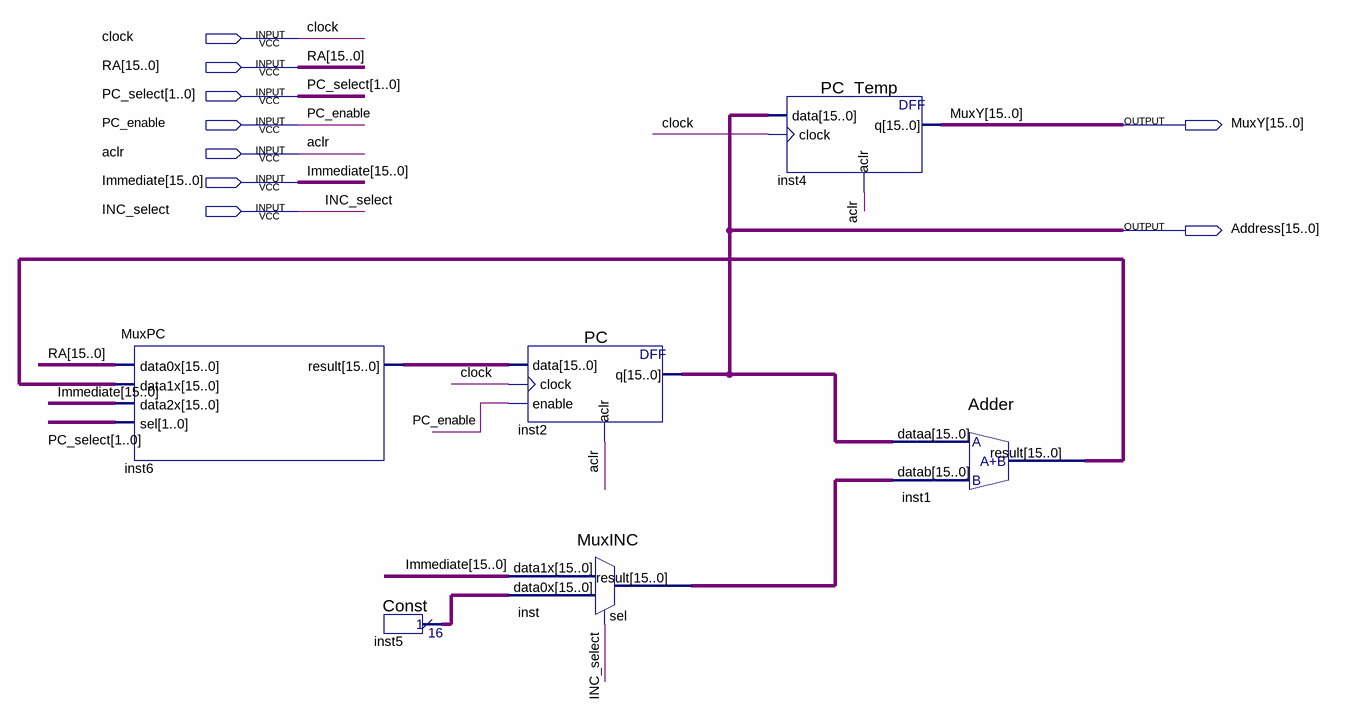
[diagram p0: schematic sheet]
// Quartus schematic InstructionAddressGenerator.bdf as structural Verilog: 6 symbols, 9 pins
module InstructionAddressGenerator (
  input  clock,
  input  [15:0] RA,
  input  [1:0] PC_select,
  input  PC_enable,
  input  aclr,
  input  [15:0] Immediate,
  input  INC_select,
  output [15:0] MuxY,
  output [15:0] Address
);

  wire [15:0] inst1_result, inst5_result, inst6_result, inst_result;

  MuxPC inst6 (.data0x(RA), .data1x(inst1_result), .data2x(Immediate), .sel(PC_select), .result(inst6_result));
  Const inst5 (.result(inst5_result));
  PC inst2 (.data(inst6_result), .clock(clock), .enable(PC_enable), .aclr(aclr), .q(Address));
  MuxINC inst (.data1x(Immediate), .data0x(inst5_result), .sel(INC_select), .result(inst_result));
  PC_Temp inst4 (.data(Address), .clock(clock), .aclr(aclr), .q(MuxY));
  Adder inst1 (.dataa(Address), .datab(inst_result), .result(inst1_result));
endmodule
